# Altium schematic sheet OSU_Robotics_Kids.SchDoc
size A
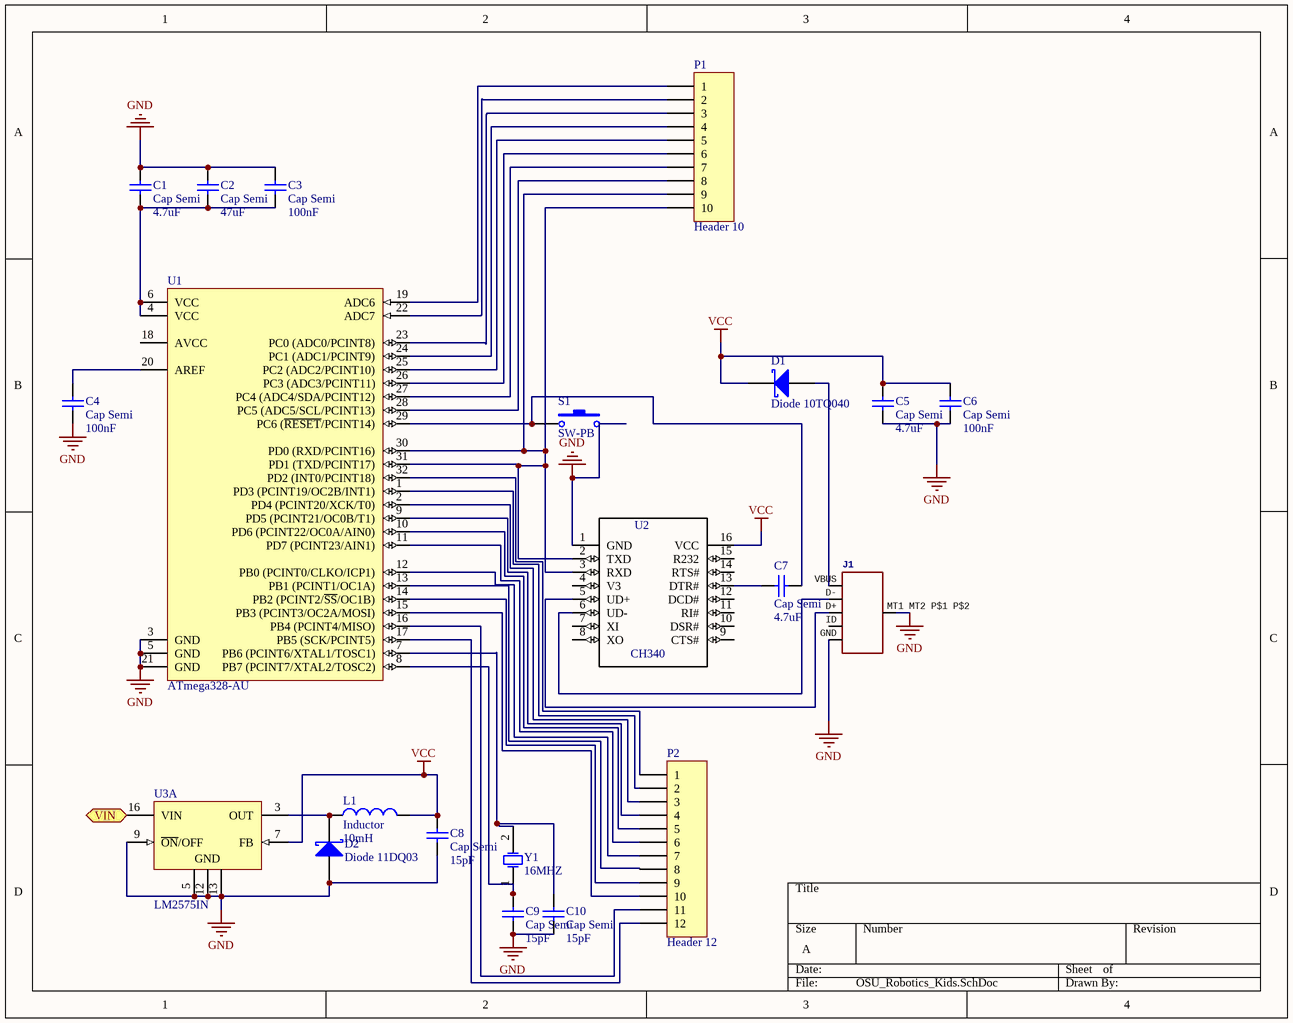
[diagram p0: OSU_Robotics_Kids.SchDoc]

## Parts
C1  Cap Semi  value 4.7uF  [C1206]
C2  Cap Semi  value 47uF  [C1206]
C3  Cap Semi  value 100nF  [C1206]
C4  Cap Semi  value 100nF  [C1206]
C5  Cap Semi  value 4.7uF  [C1206]
C6  Cap Semi  value 100nF  [C1206]
C7  Cap Semi  value 4.7uF  [C1206]
C8  Cap Semi  value 15pF  [C1206]
C9  Cap Semi  value 15pF  [C1206]
C10  Cap Semi  value 15pF  [C1206]
D1  Diode 10TQ040  [TO-220AC]
D2  Diode 11DQ03  [DO-204AL]
J1  (no value)  [USB-MICROB]
L1  Inductor  value 10mH  [INDC3216]
P1  Header 10  [HDR1X10]
P2  Header 12  [HDR1X12]
S1  SW-PB  [SPST-2]
U1  ATmega328-AU  [32A_N]
U2  CH340  [SO16]
U3  LM2575IN  [N16]  (part A of 2)
Y1  16MHZ  [R38]

## Ports
VIN (in)

## Nets
GND: C1.2 C2.2 C3.2 C4.1 C5.1 C6.1 C8.1 C9.1 C10.1 D2.1(A) J1.GND J1.MT1_MT2_P$1_P$2(SHIELD) S1.2 U1.3(GND) U1.5(GND) U1.21(GND) U2.1(GND) U3.5(GND) U3.9(~{ON}/OFF) U3.12(GND) U3.13(GND)
VCC: C5.2 C6.2 C8.2 D1.1(K) L1.2 U2.16(VCC) U3.7(FB)
VIN: U3.16(VIN) ; port VIN
NetC1_1: C1.1 C2.1 C3.1 U1.4(VCC) U1.6(VCC)
NetC4_2: C4.2 U1.20(AREF)
NetC7_1: C7.1 S1.1 U1.29(PC6_(~{RESET}/PCINT14))
NetC7_2: C7.2 U2.13(DTR#)
NetC9_2: C9.2 U1.8(PB7_(PCINT7/XTAL2/TOSC2)) Y1.1(OSC1)
NetC10_2: C10.2 U1.7(PB6_(PCINT6/XTAL1/TOSC1)) Y1.2(OSC2)
NetD1_3: D1.3(A) J1.VBUS
NetD2_2: D2.2(K) L1.1 U3.3(OUT)
NetJ1_D+: J1.D+ U2.5(UD+)
NetJ1_D-: J1.D- U2.6(UD-)
NetP1_1: P1.1 U1.19(ADC6)
NetP1_2: P1.2 U1.22(ADC7)
NetP1_3: P1.3 U1.23(PC0_(ADC0/PCINT8))
NetP1_4: P1.4 U1.24(PC1_(ADC1/PCINT9))
NetP1_5: P1.5 U1.25(PC2_(ADC2/PCINT10))
NetP1_6: P1.6 U1.26(PC3_(ADC3/PCINT11))
NetP1_7: P1.7 U1.27(PC4_(ADC4/SDA/PCINT12))
NetP1_8: P1.8 U1.28(PC5_(ADC5/SCL/PCINT13))
NetP1_9: P1.9 P1.10 U1.30(PD0_(RXD/PCINT16)) U1.31(PD1_(TXD/PCINT17)) U2.2(TXD) U2.3(RXD)
NetP2_1: P2.1 U1.32(PD2_(INT0/PCINT18))
NetP2_2: P2.2 U1.1(PD3_(PCINT19/OC2B/INT1))
NetP2_3: P2.3 U1.2(PD4_(PCINT20/XCK/T0))
NetP2_4: P2.4 U1.9(PD5_(PCINT21/OC0B/T1))
NetP2_5: P2.5 U1.10(PD6_(PCINT22/OC0A/AIN0))
NetP2_6: P2.6 U1.11(PD7_(PCINT23/AIN1))
NetP2_7: P2.7 U1.12(PB0_(PCINT0/CLKO/ICP1))
NetP2_8: P2.8 U1.13(PB1_(PCINT1/OC1A))
NetP2_9: P2.9 U1.14(PB2_(PCINT2/~{SS}/OC1B))
NetP2_10: P2.10 U1.15(PB3_(PCINT3/OC2A/MOSI))
NetP2_11: P2.11 U1.16(PB4_(PCINT4/MISO))
NetP2_12: P2.12 U1.17(PB5_(SCK/PCINT5))

Not connected (* = marked no-connect by the designer): J1 ID; U1 18(AVCC); U2 4(V3) 7(XI) 8(XO) 9(CTS#) 10(DSR#) 11(RI#) 12(DCD#) 14(RTS#) 15(R232)

## Library data of the parts
C1-C10 = Cap Semi: Capacitor (Semiconductor SIM Model); Published: 8-Jun-2000; LatestRevisionDate: 29-May-2009; LatestRevisionNote: IPC-7351 Footprint Added.; PackageReference: C1206; Publisher: Altium Limited; PackageDescription: Chip Capacitor
D1 = Diode 10TQ040: Schottky Rectifier; Note: Terminal 2 is the TAB and is electrically connected to the cathode; Published: 8-Jun-2000; LatestRevisionDate: 17-Jul-2002; LatestRevisionNote: Re-released for DXP Platform.; DatasheetVersion: PD-2.057B; PackageVersion: Feb-1998; PackageReference: TO-220AC; Publisher: Altium Limited; PackageDescription: TO, Thru-Hole, Vertical, Heatsink Mounted; 3 In-Line Leads (1 Absent); Pitch 2.54 mm; ComponentLink1Description: Manufacturer Link; ComponentLink1URL: http://www.irf.com/
D2 = Diode 11DQ03: Schottky Rectifier; Published: 8-Jun-2000; LatestRevisionDate: 17-Jul-2002; LatestRevisionNote: Re-released for DXP Platform.; DatasheetVersion: Dec-1997; PackageReference: DO-204AL; Publisher: Altium Limited; PackageDescription: Diode, Axial; Body 5.2 x 2.7 mm (LxDia. max), Lead Dia. 0.86 mm (max); Code_JEDEC: DO-204-AL; ComponentLink1Description: Manufacturer Link; ComponentLink1URL: http://www.irf.com/; ComponentLink2Description: Datasheet; ComponentLink2URL: http://www.irf.com/product-info/datasheets/data/11dq03.pdf
J1 = USB_MICRO-B_SMT: PROD_ID: CONN-09505; SF_ID: PRT-08533
L1 = Inductor: Code_IEC: 1005; Published: 8-Jun-2000; LatestRevisionDate: 29-May-2009; LatestRevisionNote: IPC-7351 Footprint Added.; PackageReference: 0402-A; Publisher: Altium Limited; PackageDescription: Chip Inductor; Code_JEITA: 0402
P1 = Header 10: Header, 10-Pin; LatestRevisionDate: 17-Jul-2002; LatestRevisionNote: Re-released for DXP Platform.; Publisher: Altium Limited
P2 = Header 12: Header, 12-Pin; LatestRevisionDate: 17-Jul-2002; LatestRevisionNote: Re-released for DXP Platform.; Publisher: Altium Limited
S1 = SW-PB: Switch; Published: 24-Mar-1999; LatestRevisionDate: 17-Jul-2002; LatestRevisionNote: Re-released for DXP Platform.; PackageReference: SPST-2; Publisher: Altium Limited; PackageDescription: Switch; 2 Leads
U1 = ATmega328-AU: 8-bit AVR Microcontroller, 32KB Flash, 1KB EEPROM, 2KB SRAM, 32-pin TQFP, Industrial Grade (-40°C to 85°C); DatasheetVersion: revD, May-2011; PackageVersion: revC, Oct-2010; PackageReference: 32A; PackageDescription: 32-Lead, 7x7x1.0 mm Body, 0.8mm Lead Pitch, Thin Profile Plastic Quad Flat Package (TQFP); Code_JEDEC: MS-026-ABA; ComponentLink1Description: Manufacturer URL; ComponentLink1URL: http://www.atmel.com/; ComponentLink2Description: ATmega48A/48PA/88A/88PA/168A/168PA/328/328P Datasheet; ComponentLink2URL: http://www.atmel.com/dyn/resources/prod_documents/doc8271.pdf; ComponentLink3Description: ATmega48A/48PA/88A/88PA/168A/168PA/328/328P Summary; ComponentLink3URL: http://www.atmel.com/dyn/resources/prod_documents/8271S.pdf
U2 = CH340: Eaton / Cutler Hammer CH340 Circuit Breaker 40 Amp 240 Volt AC 3-Pole Plug-On Mount; Package: None; MF: Eaton / Cutler Hammer; Availability: Bad; SnapEDA_Link: https://www.snapeda.com/parts/CH340/Eaton%20/%20Cutler%20Hammer/view-part/?ref=snap; MP: CH340; Price: 220.05 USD; Value: *
U3 = LM2575IN: Buck Adjustable Regulator with 4.75 to 40 V Input and 1.23 to 37 V Output, -40 to 125 degC, 16-Pin PDIP (N), Pb-Free (RoHS); Manufacturer: Texas Instruments; Duty Cycle(Max)(%): 98; Iout(Max)(A): 1; Iq(Typ)(mA): 5; Rating: Catalog; SubFamily: Step-Down Regulator; Switch Current Limit(Typ)(A): 3; Vin(Max)(V): 40; Vin(Min)(V): 4.75; Vout(Max)(V): 37; Vout(Min)(V): 1.23; DatasheetVersion: SLVS569E; PackageVersion: revE, Dec-2002; PackageReference: N16; PackageDescription: 16-Pin Plastic Dual-In-Line Package, Row Spacing 7.62 mm, Pitch 2.54 mm; Supplier 1: Digi-Key; Supplier Part Number 1: 296-20850-5-ND; Supplier 2: Farnell; Supplier Part Number 2: 1755089; Supplier 3: Newark; Supplier Part Number 3: 52K5741; Supplier 4: Mouser; Supplier Part Number 4: 595-LM2575IN; Eco-Plan: Pb-Free (RoHS); Regulated Outputs(#): 1; Topology: Buck; Mounting Technology: Through Hole; Code_JEDEC: MS-001*; PartNumber: LM2575IN; ComponentLink1Description: Datasheet; ComponentLink1URL: http://www.ti.com/general/docs/lit/getliterature.tsp?genericPartNumber=LM2575&fileType=pdf; ComponentLink2Description: Package Specification; ComponentLink2URL: http://www.ti.com/litv/pdf/mpdi002c; ComponentLink3Description: URL Link1; ComponentLink3URL: Samples URL:http://www.ti.com/product/lm2575#samples
Y1 = XTAL: Crystal Oscillator; Published: 8-Jun-2000; LatestRevisionDate: 17-Jul-2002; LatestRevisionNote: Re-released for DXP Platform.; PackageReference: R38; Publisher: Altium Limited; PackageDescription: Crystal, Thru-Hole; 2 Leads; Body 3.1 x 8.2 mm (Dia.xH)